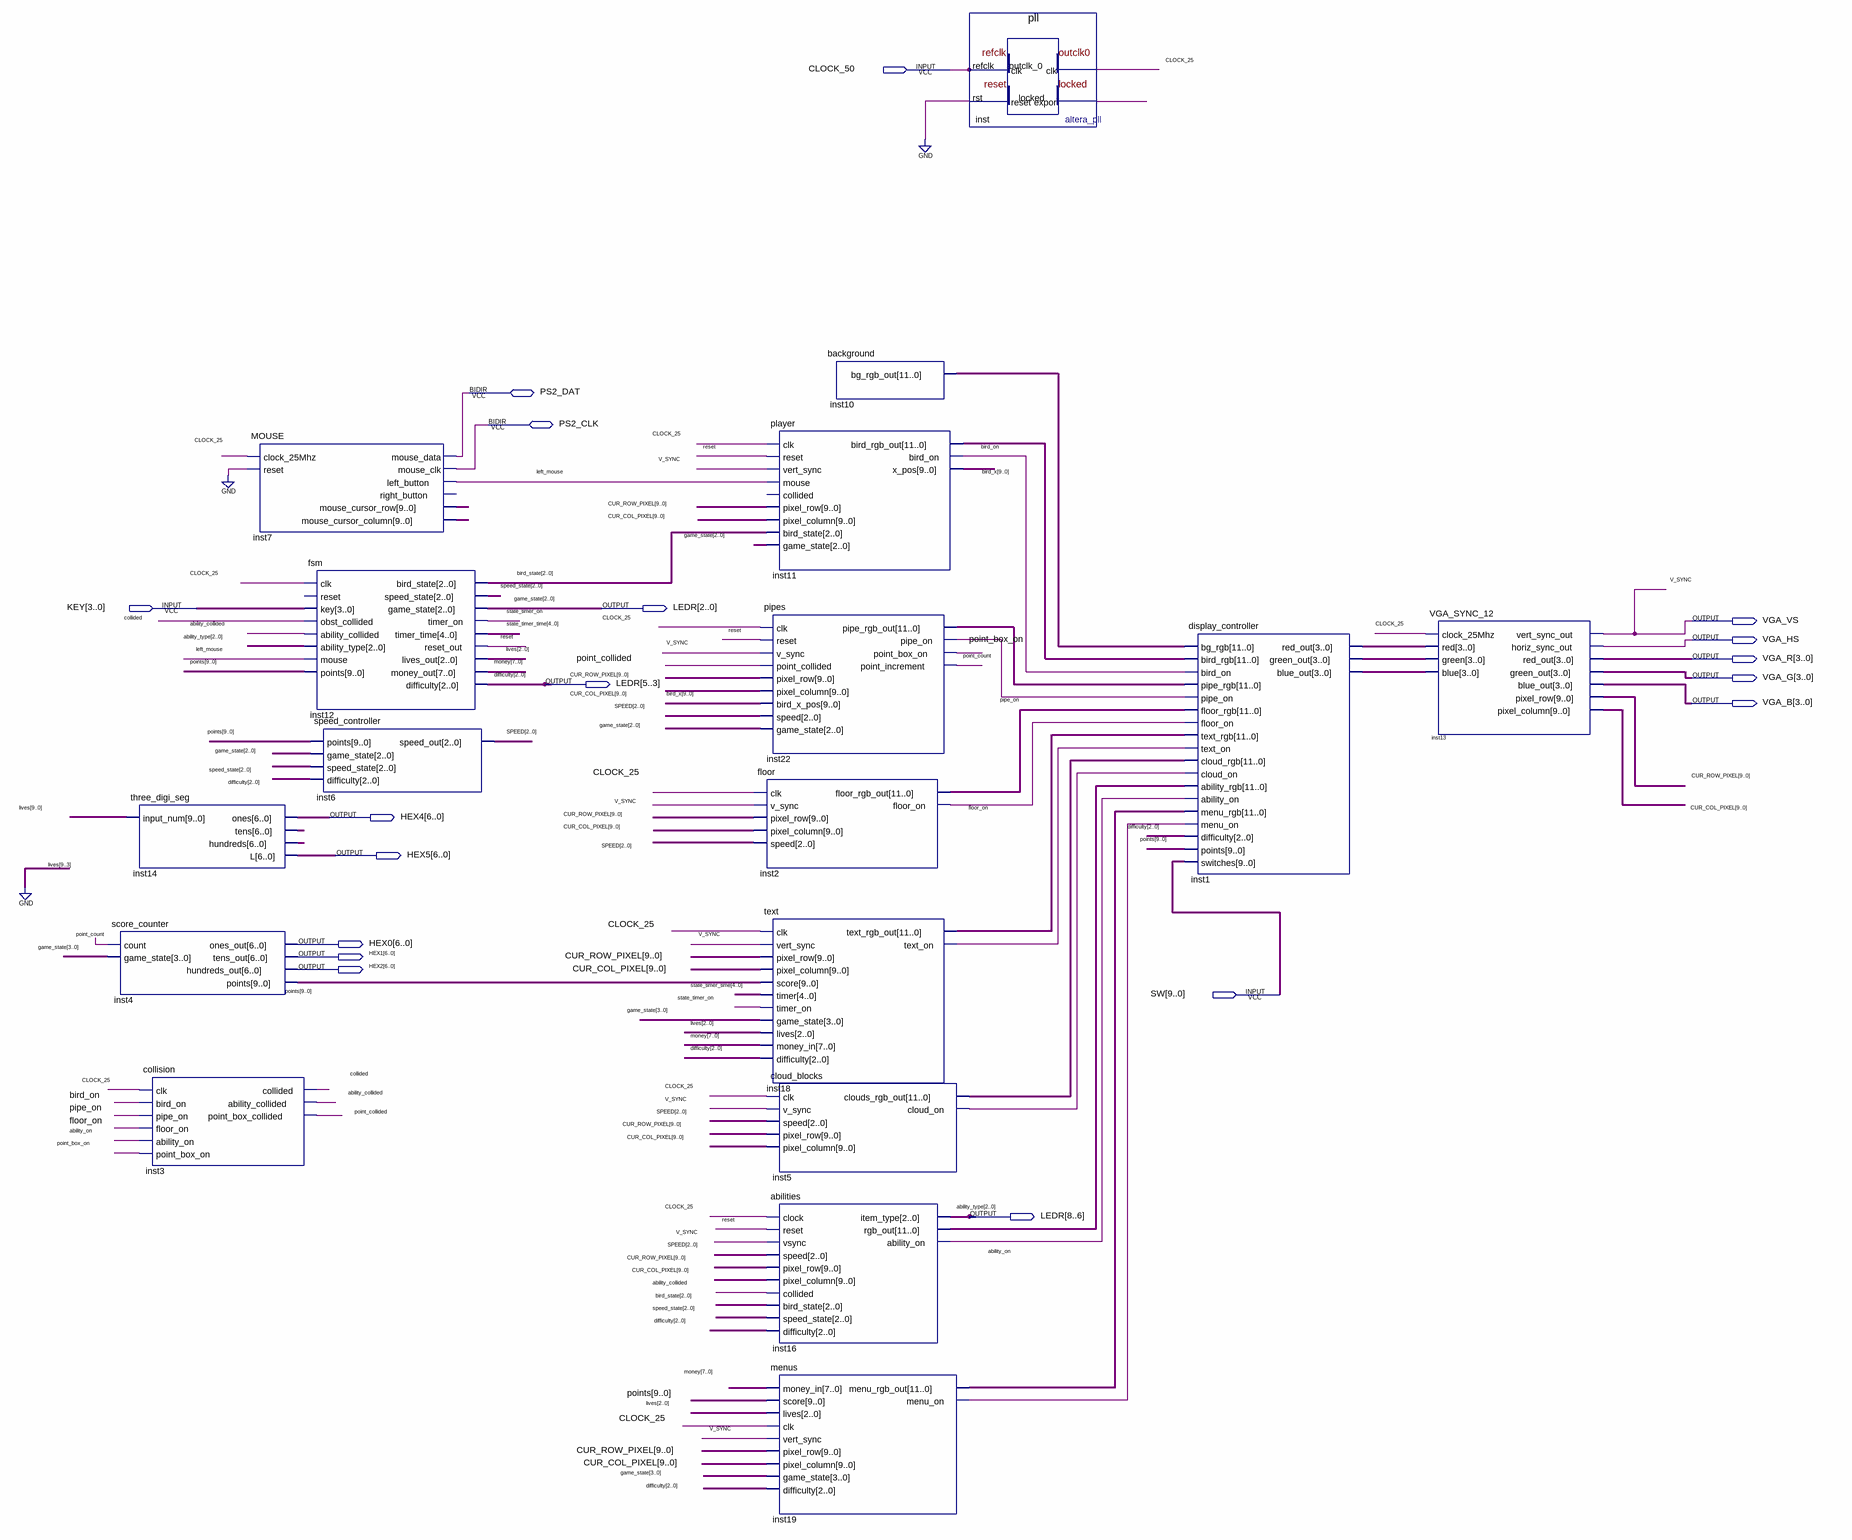
[diagram p0: schematic sheet]
// Quartus schematic FlappyBird_305.bdf as structural Verilog: 17 symbols, 18 pins
module FlappyBird_305 (
  input  CLOCK_50,
  input  [3:0] KEY,
  input  [9:0] SW,
  inout  PS2_DAT,
  inout  PS2_CLK,
  output [8:0] LEDR,
  output VGA_VS,
  output VGA_HS,
  output [3:0] VGA_R,
  output [3:0] VGA_G,
  output [3:0] VGA_B,
  output [6:0] HEX4,
  output [6:0] HEX5,
  output [6:0] HEX0,
  output [6:0] HEX1,
  output [6:0] HEX2
);

  wire ability_collided, ability_on, bird_on, CLOCK_25, collided, floor_on, inst5_cloud_on, inst18_text_on,
       inst19_menu_on, inst_locked, left_mouse, pipe_on, point_box_on, point_collided, point_count, reset,
       state_timer_on;
  wire [2:0] bird_state, lives, SPEED, speed_state;
  wire [3:0] inst1_blue_out, inst1_green_out, inst1_red_out;
  wire [3:3] game_state;
  wire [4:0] state_timer_time;
  wire [6:0] inst14_hundreds, inst14_tens;
  wire [7:0] money;
  wire [9:0] bird_x, CUR_COL_PIXEL, CUR_ROW_PIXEL, inst7_mouse_cursor_column, inst7_mouse_cursor_row, points;
  wire [11:0] inst2_floor_rgb_out, inst5_clouds_rgb_out, inst10_bg_rgb_out, inst11_bird_rgb_out,
       inst16_rgb_out, inst18_text_rgb_out, inst19_menu_rgb_out, inst22_pipe_rgb_out;

  three_digi_seg inst14 (
    .input_num({{7{1'b0}}, lives}), .ones(HEX4), .tens(inst14_tens), .hundreds(inst14_hundreds), .L(HEX5));
  score_counter inst4 (
    .count(point_count), .game_state({game_state[3], LEDR[2:0]}), .ones_out(HEX0), .tens_out(HEX1),
    .hundreds_out(HEX2), .points(points));
  collision inst3 (
    .clk(CLOCK_25), .bird_on(bird_on), .pipe_on(pipe_on), .floor_on(floor_on), .ability_on(ability_on),
    .point_box_on(point_box_on), .collided(collided), .ability_collided(ability_collided),
    .point_box_collided(point_collided));
  MOUSE inst7 (
    .clock_25Mhz(CLOCK_25), .reset(1'b0), .left_button(left_mouse),
    .mouse_cursor_row(inst7_mouse_cursor_row), .mouse_cursor_column(inst7_mouse_cursor_column),
    .mouse_data(PS2_DAT), .mouse_clk(PS2_CLK));  // open: right_button
  fsm inst12 (
    .clk(CLOCK_25), .key(KEY), .obst_collided(collided), .ability_collided(ability_collided),
    .ability_type(LEDR[8:6]), .mouse(left_mouse), .points(points), .bird_state(bird_state),
    .speed_state(speed_state), .game_state(LEDR[2:0]), .timer_on(state_timer_on),
    .timer_time(state_timer_time), .reset_out(reset), .lives_out(lives), .money_out(money),
    .difficulty(LEDR[5:3]));  // open: reset
  speed_controller inst6 (
    .points(points), .game_state(LEDR[2:0]), .speed_state(speed_state), .difficulty(LEDR[5:3]),
    .speed_out(SPEED));
  pipes inst22 (
    .clk(CLOCK_25), .reset(reset), .v_sync(VGA_VS), .point_collided(point_collided),
    .pixel_row(CUR_ROW_PIXEL), .pixel_column(CUR_COL_PIXEL), .bird_x_pos(bird_x), .speed(SPEED),
    .game_state(LEDR[2:0]), .pipe_rgb_out(inst22_pipe_rgb_out), .pipe_on(pipe_on),
    .point_box_on(point_box_on), .point_increment(point_count));
  floor inst2 (
    .clk(CLOCK_25), .v_sync(VGA_VS), .pixel_row(CUR_ROW_PIXEL), .pixel_column(CUR_COL_PIXEL), .speed(SPEED),
    .floor_rgb_out(inst2_floor_rgb_out), .floor_on(floor_on));
  text inst18 (
    .clk(CLOCK_25), .vert_sync(VGA_VS), .pixel_row(CUR_ROW_PIXEL), .pixel_column(CUR_COL_PIXEL),
    .score(points), .timer(state_timer_time), .timer_on(state_timer_on),
    .game_state({game_state[3], LEDR[2:0]}), .lives(lives), .money_in(money), .difficulty(LEDR[5:3]),
    .text_rgb_out(inst18_text_rgb_out), .text_on(inst18_text_on));
  player inst11 (
    .clk(CLOCK_25), .reset(reset), .vert_sync(VGA_VS), .mouse(left_mouse), .pixel_row(CUR_ROW_PIXEL),
    .pixel_column(CUR_COL_PIXEL), .bird_state(bird_state), .game_state(LEDR[2:0]),
    .bird_rgb_out(inst11_bird_rgb_out), .bird_on(bird_on), .x_pos(bird_x));  // open: collided
  cloud_blocks inst5 (
    .clk(CLOCK_25), .v_sync(VGA_VS), .speed(SPEED), .pixel_row(CUR_ROW_PIXEL), .pixel_column(CUR_COL_PIXEL),
    .clouds_rgb_out(inst5_clouds_rgb_out), .cloud_on(inst5_cloud_on));
  abilities inst16 (
    .clock(CLOCK_25), .reset(reset), .vsync(VGA_VS), .speed(SPEED), .pixel_row(CUR_ROW_PIXEL),
    .pixel_column(CUR_COL_PIXEL), .collided(ability_collided), .bird_state(bird_state),
    .speed_state(speed_state), .difficulty(LEDR[5:3]), .item_type(LEDR[8:6]), .rgb_out(inst16_rgb_out),
    .ability_on(ability_on));
  menus inst19 (
    .money_in(money), .score(points), .lives(lives), .clk(CLOCK_25), .vert_sync(VGA_VS),
    .pixel_row(CUR_ROW_PIXEL), .pixel_column(CUR_COL_PIXEL), .game_state({game_state[3], LEDR[2:0]}),
    .difficulty(LEDR[5:3]), .menu_rgb_out(inst19_menu_rgb_out), .menu_on(inst19_menu_on));
  background inst10 (.bg_rgb_out(inst10_bg_rgb_out));
  pll inst (.refclk(CLOCK_50), .rst(1'b0), .outclk_0(CLOCK_25), .locked(inst_locked));
  display_controller inst1 (
    .bg_rgb(inst10_bg_rgb_out), .bird_rgb(inst11_bird_rgb_out), .bird_on(bird_on),
    .pipe_rgb(inst22_pipe_rgb_out), .pipe_on(pipe_on), .floor_rgb(inst2_floor_rgb_out), .floor_on(floor_on),
    .text_rgb(inst18_text_rgb_out), .text_on(inst18_text_on), .cloud_rgb(inst5_clouds_rgb_out),
    .cloud_on(inst5_cloud_on), .ability_rgb(inst16_rgb_out), .ability_on(ability_on),
    .menu_rgb(inst19_menu_rgb_out), .menu_on(inst19_menu_on), .difficulty(LEDR[5:3]), .points(points),
    .switches(SW), .red_out(inst1_red_out), .green_out(inst1_green_out), .blue_out(inst1_blue_out));
  VGA_SYNC_12 inst13 (
    .clock_25Mhz(CLOCK_25), .red(inst1_red_out), .green(inst1_green_out), .blue(inst1_blue_out),
    .vert_sync_out(VGA_VS), .horiz_sync_out(VGA_HS), .red_out(VGA_R), .green_out(VGA_G), .blue_out(VGA_B),
    .pixel_row(CUR_ROW_PIXEL), .pixel_column(CUR_COL_PIXEL));

  // Other names for the same wires on the sheet: game_state[2:0] = LEDR[2:0]; difficulty[2:0] = LEDR[5:3];
  //   ability_type[2:0] = LEDR[8:6]; V_SYNC = VGA_VS
endmodule
